# Altium schematic sheet Expansion Board.SchDoc
size Letter
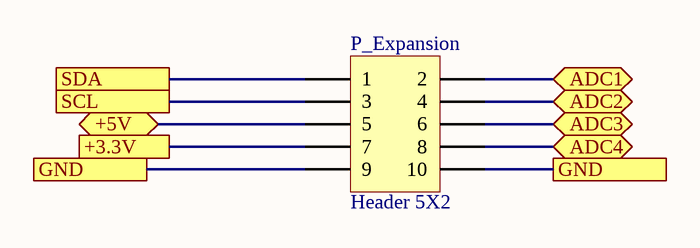
[diagram p0: Expansion Board.SchDoc]

## Parts
P_Expansion  Header 5X2  [HDR2X5]

## Ports
+3.3V, +5V, ADC1, ADC2, ADC3, ADC4, GND, SCL, SDA

## Nets
+3.3V: P_Expansion.7 ; port +3.3V
+5V: P_Expansion.5 ; port +5V
ADC1: P_Expansion.2 ; port ADC1
ADC2: P_Expansion.4 ; port ADC2
ADC3: P_Expansion.6 ; port ADC3
ADC4: P_Expansion.8 ; port ADC4
GND: P_Expansion.9 P_Expansion.10 ; port GND
SCL: P_Expansion.3 ; port SCL
SDA: P_Expansion.1 ; port SDA

## Library data of the parts
P_Expansion = Header 5X2: Header, 5-Pin, Dual row; LatestRevisionDate: 17-Jul-2002; LatestRevisionNote: Re-released for DXP Platform.; Publisher: Altium Limited